# Altium schematic sheet Smart Bottle.SchDoc
size A; SheetNumber: 1; SheetTotal: 1
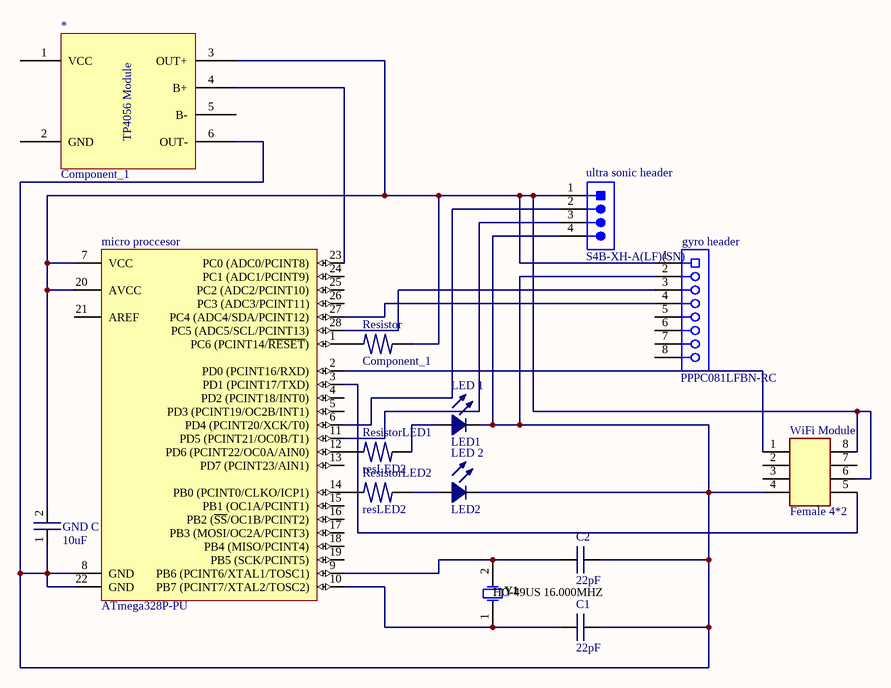
[diagram p0: Smart Bottle.SchDoc]

## Parts
*  Component_1  [TP4056_6PINs]
C1  22pF  [CAPACITOR 103]
C2  22pF  [CAPACITOR 103]
GND_C  10uF  [CAPACITOR 103]
gyro_header  PPPC081LFBN-RC  [SLIN-PPPC081LFBN-RC_V]
LED_1  LED1  [LED_5mm_RED]
LED_2  LED2  [LED_5mm_RED]
micro_proccesor  ATmega328P-PU  [28P3]
Resistor  Component_1  [RESSITOR_PTH_12.5mm]
ResistorLED1  resLED2  [RESSITOR_PTH_12.5mm]
ResistorLED2  resLED2  [RESSITOR_PTH_12.5mm]
ultra_sonic_header  S4B-XH-A(LF)(SN)  [JST-S4B-XH-A(LF)(SN)_V]
WiFi_Module  Female 4*2  [FEMALE_4X2]
Y1  HC-49US 16.000MHZ  [JPY-HC-49US]

## Nets
Net*_3: *.3(OUT+) GND_C.2 gyro_header.1 micro_proccesor.7(VCC) micro_proccesor.20(AVCC) Resistor.2 ultra_sonic_header.1 WiFi_Module.6 WiFi_Module.8
Net*_4: *.4(B+) micro_proccesor.23(PC0_(ADC0/PCINT8))
Net*_6: *.6(OUT-) C1.2 C2.2 GND_C.1 gyro_header.2 LED_1.2 LED_2.2 micro_proccesor.8(GND) micro_proccesor.22(GND) ultra_sonic_header.4 WiFi_Module.4
NetC1_1: C1.1 micro_proccesor.10(PB7_(PCINT7/XTAL2/TOSC2)) Y1.1
NetC2_1: C2.1 micro_proccesor.9(PB6_(PCINT6/XTAL1/TOSC1)) Y1.2
Netgyro_header_3: gyro_header.3 micro_proccesor.28(PC5_(ADC5/SCL/PCINT13))
Netgyro_header_4: gyro_header.4 micro_proccesor.27(PC4_(ADC4/SDA/PCINT12))
NetLED_1_1: LED_1.1 ResistorLED1.2
NetLED_2_1: LED_2.1 ResistorLED2.2
Netmicro_proccesor_1: micro_proccesor.1(PC6_(PCINT14/~{RESET})) Resistor.1
Netmicro_proccesor_2: micro_proccesor.2(PD0_(PCINT16/RXD)) WiFi_Module.1
Netmicro_proccesor_3: micro_proccesor.3(PD1_(PCINT17/TXD)) WiFi_Module.5
Netmicro_proccesor_6: micro_proccesor.6(PD4_(PCINT20/XCK/T0)) ultra_sonic_header.2
Netmicro_proccesor_11: micro_proccesor.11(PD5_(PCINT21/OC0B/T1)) ultra_sonic_header.3
Netmicro_proccesor_12: micro_proccesor.12(PD6_(PCINT22/OC0A/AIN0)) ResistorLED1.1
Netmicro_proccesor_14: micro_proccesor.14(PB0_(PCINT0/CLKO/ICP1)) ResistorLED2.1

Not connected (* = marked no-connect by the designer): * 1(VCC) 2(GND) 5(B-); gyro_header 5 6 7 8; micro_proccesor 4(PD2_(PCINT18/INT0)) 5(PD3_(PCINT19/OC2B/INT1)) 13(PD7_(PCINT23/AIN1)) 15(PB1_(OC1A/PCINT1)) 16(PB2_(~{SS}/OC1B/PCINT2)) 17(PB3_(MOSI/OC2A/PCINT3)) 18(PB4_(MISO/PCINT4)) 19(PB5_(SCK/PCINT5)) 21(AREF) 24(PC1_(ADC1/PCINT9)) 25(PC2_(ADC2/PCINT10)) 26(PC3_(ADC3/PCINT11)); WiFi_Module 2 3 7

## Notes on the sheet
- (in symbol Component_1) TP4056 Module

## Library data of the parts
C1 C2 GND_C LED_1 LED_2 ResistorLED1 ResistorLED2 WiFi_Module = Component_1
gyro_header = CMP-002-00028-2: Female Header, Pitch 2.54 mm, 1 x 8 Position, Height 8.5 mm, Tail Length 3.2 mm, -40 to 105 degC, RoHS, Bulk; Manufacturer: Sullins; Package Reference: PPPC081LFBN-RC; Connector Type: Header; Datasheet Version: Jan-15; Package Description: Female Header, Pitch 2.54 mm, 1 x 8 Position, Height 8.5 mm, Tail Length 3.2 mm; RoHS Compliant: Unknown; Max Operating Temperature: 105°C; Case/Package: PPPC081LFBN-RC; Min Operating Temperature: -40°C; Datasheet URL: http://sullinscorp.com/catalogs/101_PAGE114-115_.100_FEMALE_HDR.pdf; Gender: Female; Mounting Technology: TH
micro_proccesor = CMP-0095-00013-2: 8-bit AVR Microcontroller, 32KB Flash, 1KB EEPROM, 2KB SRAM, 28-pin PDIP, Industrial Grade (-40°C to 85°C); RevisionNote: DatasheetVersion updated. URLs added.; PackageVersion: revB, Sep-2001; PackageDescription: 28-lead (0.300"/7.62mm Wide) Plastic Dual Inline Package (PDIP); DatasheetVersion: revD, May-2011; ComponentLink1Description: Manufacturer URL; ComponentLink1URL: http://www.atmel.com/; PackageReference: 28P3; ComponentLink2Description: ATmega48A/48PA/88A/88PA/168A/168PA/328/328P Datasheet; ComponentLink3URL: http://www.atmel.com/dyn/resources/prod_documents/8271S.pdf; ComponentLink2URL: http://www.atmel.com/dyn/resources/prod_documents/8271.pdf; ComponentLink3Description: ATmega48A/48PA/88A/88PA/168A/168PA/328/328P Summary
ultra_sonic_header = CMP-002-00034-2: Male Header, Pitch 2.5 mm, 1 x 4 Position, Height 6.1 mm, Tail Length 3.4 mm, -25 to 85 degC, RoHS, Bulk; Manufacturer: JST; Manufacturer URL: http://www.jst.com/home2.html; RoHS Compliant: Unknown; Gender: Male; Min Operating Temperature: -25°C; Datasheet URL: http://www.jst-mfg.com/product/pdf/eng/eXH.pdf; Case/Package: S4B-XH-A(LF)(SN); Datasheet Version: May-16; Mounting Technology: TH; Package Reference: S4B-XH-A(LF)(SN); Max Operating Temperature: 85°C; Package Description: XH Series Disconnectable Crimp Style Connector, Pitch 2.5 mm, 1 x 4 Position, Height 6.1 mm, Tail Length 3.4 mm; Connector Type: Header
Y1 = CMP-003-00005-2: Crystal, 16 MHz, +/- 30 ppm, 18 pF, -20 to 70 degC, 2-Pin THD; Manufacturer: Jing peng yuan; Frequency: 16MHz; Package Reference: HC-49US; Case/Package: HC-49US; RoHS Compliant: Unknown; Mounting Technology: TH; Package Description: 2-Pin Throug Hole Device, Body 11.05 x 4.65 mm, Pitch 4.9 mm; Datasheet URL: https://statics3.seeedstudio.com/images/opl/datasheet/306010014.pdf; Datasheet Version: May-15